# EAGLE design aecho (EAGLE 7.3.0)
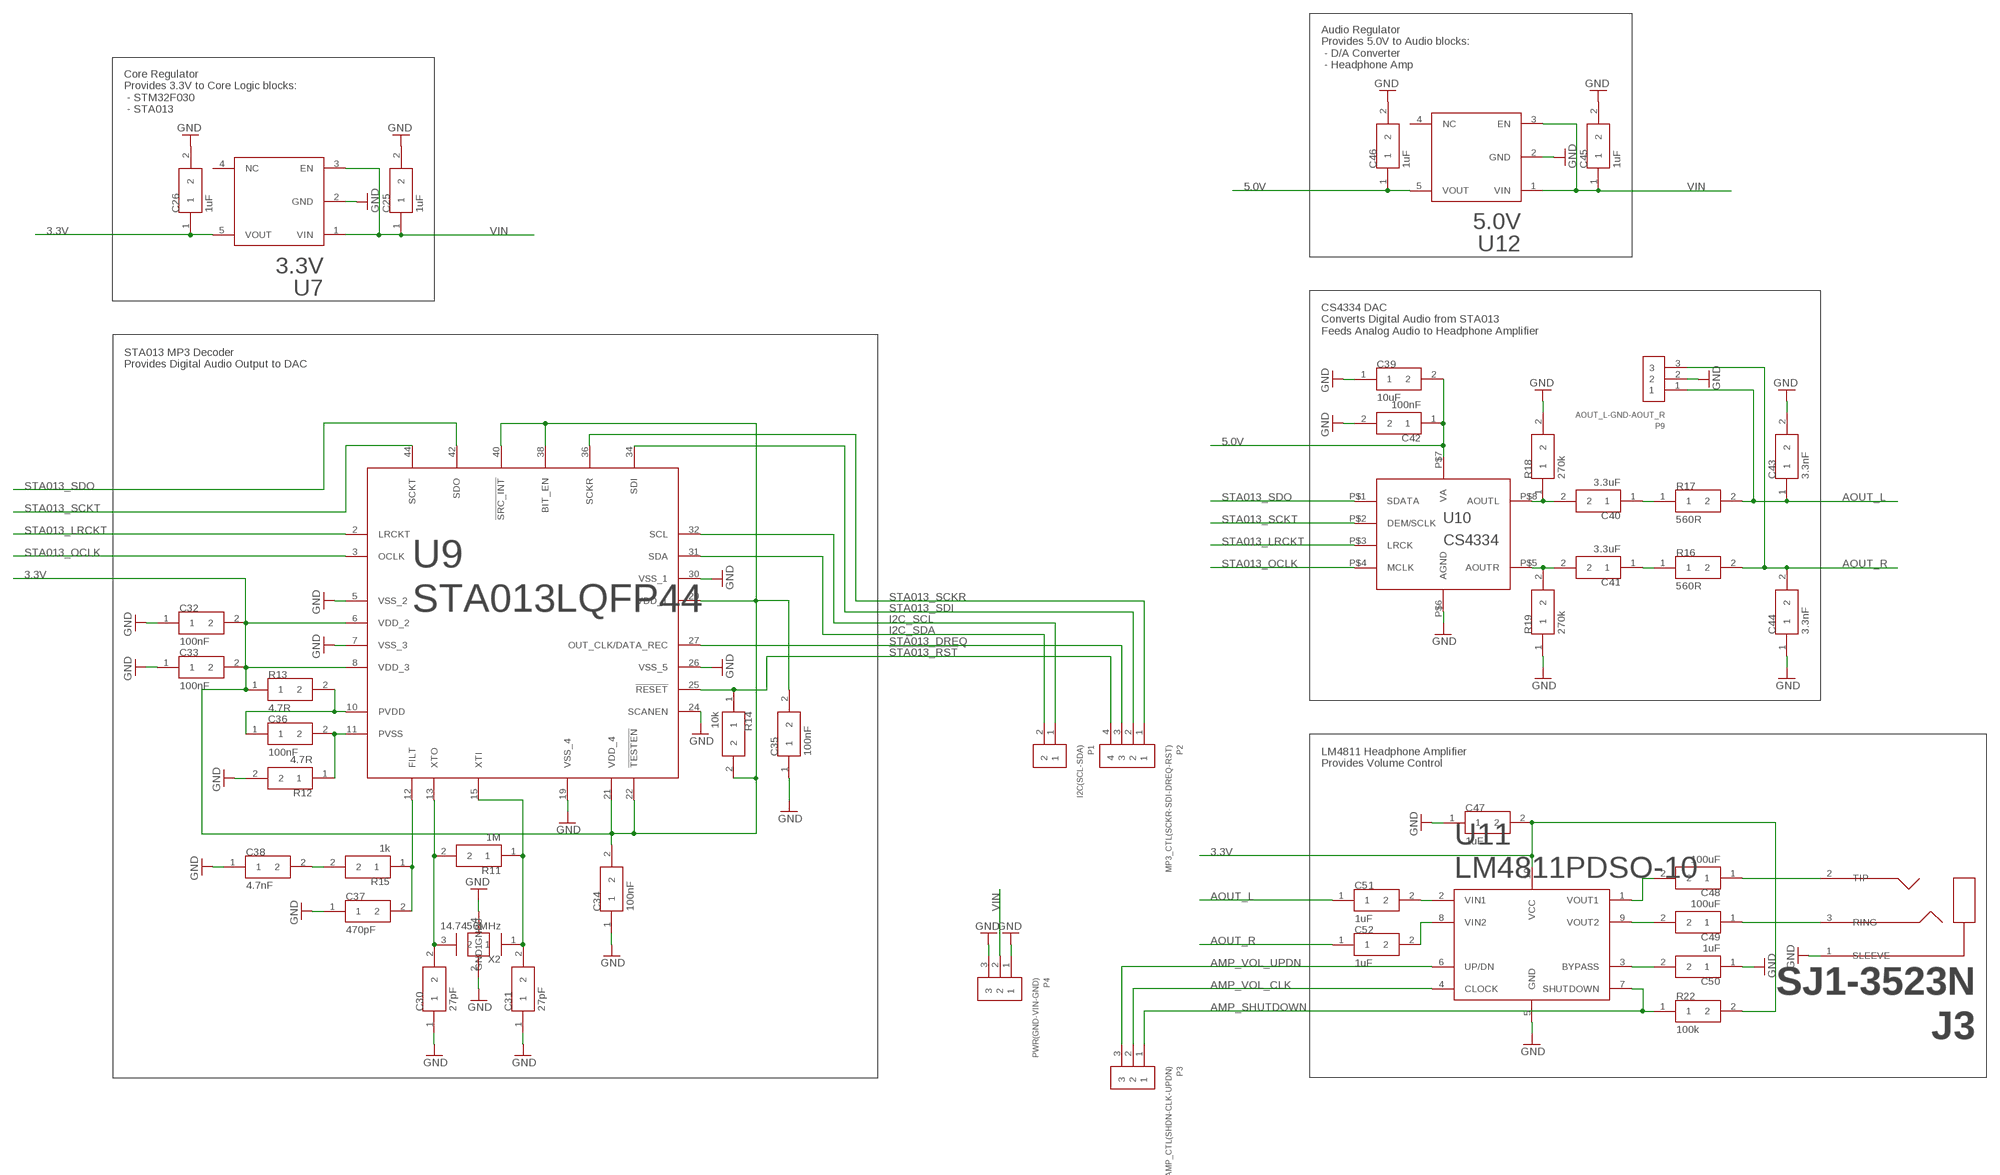
[diagram p0: schematic, sheet 1]

## Parts
C25  1uF  CAP0805  [0805]
C26  1uF  CAP0805  [0805]
C30  27pF  CAP0805  [0805]
C31  27pF  CAP0805  [0805]
C32  100nF  CAP0805  [0805]
C33  100nF  CAP0805  [0805]
C34  100nF  CAP0805  [0805]
C35  100nF  CAP0805  [0805]
C36  100nF  CAP0805  [0805]
C37  470pF  CAP0805  [0805]
C38  4.7nF  CAP0805  [0805]
C39  10uF  CAP0805  [0805]
C40  3.3uF  CAP0805  [0805]
C41  3.3uF  CAP0805  [0805]
C42  100nF  CAP0805  [0805]
C43  3.3nF  CAP0805  [0805]
C44  3.3nF  CAP0805  [0805]
C45  1uF  CAP0805  [0805]
C46  1uF  CAP0805  [0805]
C47  1uF  CAP0805  [0805]
C48  100uF  CAP1210  [1210]
C49  100uF  CAP1210  [1210]
C50  1uF  CAP0805  [0805]
C51  1uF  CAP0805  [0805]
C52  1uF  CAP0805  [0805]
J3  SJ1-3523N  [SJ1-352XN]
P1  I2C(SCL-SDA)  PIN_2  [PIN_2]
P2  MP3_CTL(SCKR-SDI-DREQ-RST)  PIN_4  [PIN_4]
P3  AMP_CTL(SHDN-CLK-UPDN)  PIN_3  [PIN_3]
P4  PWR(GND-VIN-GND)  PIN_3  [PIN_3]
P9  AOUT_L-GND-AOUT_R  PIN_3  [PIN_3]
R11  1M  RES0805  [0805]
R12  4.7R  RES0805  [0805]
R13  4.7R  RES0805  [0805]
R14  10k  RES0805  [0805]
R15  1k  RES0805  [0805]
R16  560R  RES0805  [0805]
R17  560R  RES0805  [0805]
R18  270k  RES0805  [0805]
R19  270k  RES0805  [0805]
R22  100k  RES0805  [0805]
U7  3.3V  LP3985SOT23-5  [SOT23-5]
U9  STA013LQFP44  [QFP44]
U10  CS4334  [SO8]
U11  LM4811PDSO-10  [PDSO-10]
U12  5.0V  LP3985SOT23-5  [SOT23-5]
X2  14.7456MHz  XTAL_GNDSMD_3225  [XTAL_3225]

## Nets
3.3V: C26.1 C32.2 C33.2 C34.2 C35.2 C47.2 R13.1 R14.2 R22.2 U7.5(VOUT) U9.6(VDD_2) U9.8(VDD_3) U9.21(VDD_4) U9.22(!TESTEN) U9.29(VDD_1) U9.38(BIT_EN) U9.40(!SRC_INT) U11.10(VCC)
5.0V: C39.2 C42.1 C46.1 U10.P$7(VA) U12.5(VOUT)
!STA013_RST: P2.4 R14.1 U9.25(!RESET)
AMP_SHUTDOWN: P3.1 R22.1 U11.7(SHUTDOWN)
AMP_VOL_CLK: P3.2 U11.4(CLOCK)
AMP_VOL_UPDN: P3.3 U11.6(UP/DN)
AOUT_L: C43.1 C51.1 P9.1 R17.2
AOUT_R: C44.2 C52.1 P9.3 R16.2
GND: C25.2 C26.2 C30.1 C31.1 C32.1 C33.1 C34.1 C35.1 C37.1 C38.1 C39.1 C42.2 C43.2 C44.1 C45.2 C46.2 C47.1 C50.1 J3.1(SLEEVE) P4.1 P4.3 P9.2 R12.2 R18.2 R19.1 U7.2(GND) U9.5(VSS_2) U9.7(VSS_3) U9.19(VSS_4) U9.24(SCANEN) U9.26(VSS_5) U9.30(VSS_1) U10.P$6(AGND) U11.5(GND) U12.2(GND) X2.2(GND0) X2.4(GND1)
I2C_SCL: P1.1 U9.32(SCL)
I2C_SDA: P1.2 U9.31(SDA)
N$2: C31.2 R11.1 U9.15(XTI) X2.1
N$3: C30.2 R11.2 U9.13(XTO) X2.3
N$6: C36.1 R13.2 U9.10(PVDD)
N$7: C36.2 R12.1 U9.11(PVSS)
N$8: C48.1 J3.2(TIP)
N$9: C38.2 R15.2
N$10: C40.2 R18.1 U10.P$8(AOUTL)
N$11: C37.2 R15.1 U9.12(FILT)
N$12: C41.2 R19.2 U10.P$5(AOUTR)
N$28: C41.1 R16.1
N$29: C40.1 R17.1
N$30: C48.2 U11.1(VOUT1)
N$31: C49.2 U11.9(VOUT2)
N$32: C50.2 U11.3(BYPASS)
N$34: C49.1 J3.3(RING)
N$39: C51.2 U11.2(VIN1)
N$40: C52.2 U11.8(VIN2)
STA013_DREQ: P2.3 U9.27(OUT_CLK/DATA_REC)
STA013_LRCKT: U9.2(LRCKT) U10.P$3(LRCK)
STA013_OCLK: U9.3(OCLK) U10.P$4(MCLK)
STA013_SCKR: P2.1 U9.36(SCKR)
STA013_SCKT: U9.44(SCKT) U10.P$2(DEM/SCLK)
STA013_SDI: P2.2 U9.34(SDI)
STA013_SDO: U9.42(SDO) U10.P$1(SDATA)
VIN: C25.1 C45.1 P4.2 U7.1(VIN) U7.3(EN) U12.1(VIN) U12.3(EN)
Unconnected: U7.4(NC) U12.4(NC)

## Notes on the sheet
- Audio Regulator
  Provides 5.0V to Audio blocks:
   - D/A Converter
   - Headphone Amp
- Core Regulator
  Provides 3.3V to Core Logic blocks:
   - STM32F030
   - STA013
- CS4334 DAC
  Converts Digital Audio from STA013
  Feeds Analog Audio to Headphone Amplifier
- STA013 MP3 Decoder
  Provides Digital Audio Output to DAC
- LM4811 Headphone Amplifier
  Provides Volume Control

## Library data of the parts
C25 C26 C30-C52 = dooba:CAP
J3 = dooba:SJ1-3523N
P1 = dooba:PIN_2
P2 = dooba:PIN_4
P3 P4 P9 = dooba:PIN_3
R11-R19 R22 = dooba:RES
U7 U12 = dooba:LP3985
U9 = dooba:STA013
U10 = dooba:CS4334
U11 = dooba:LM4811
X2 = dooba:XTAL_GND

## Board
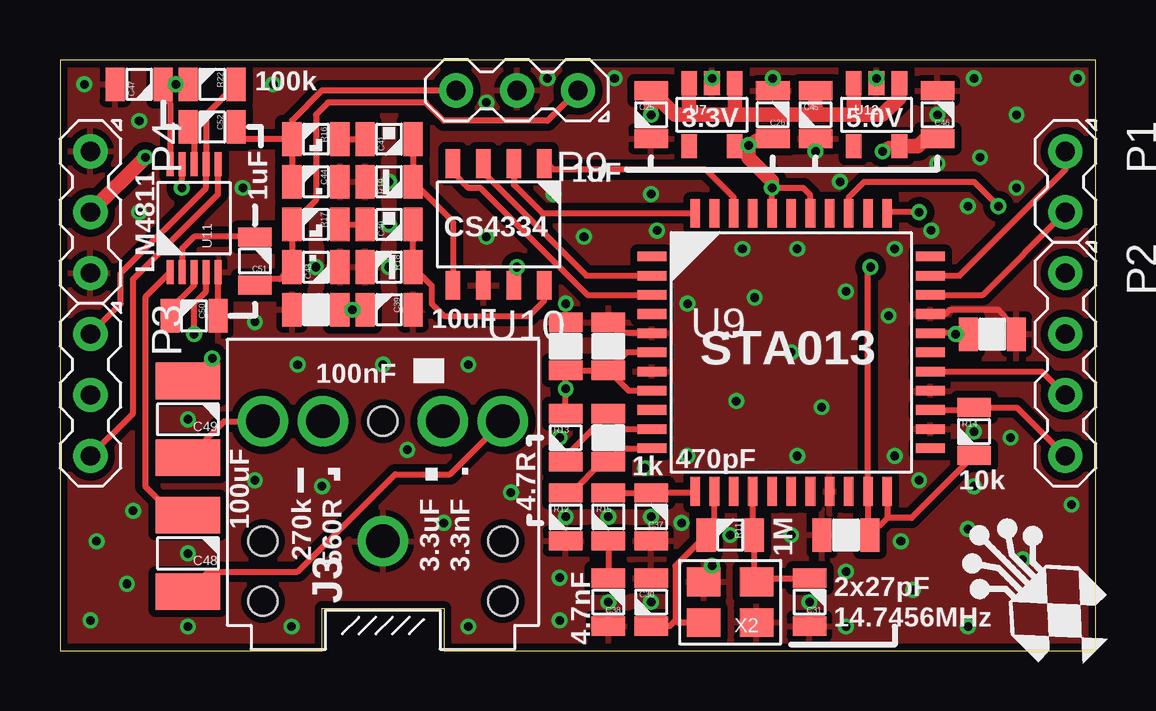
[diagram p1: board, top side]
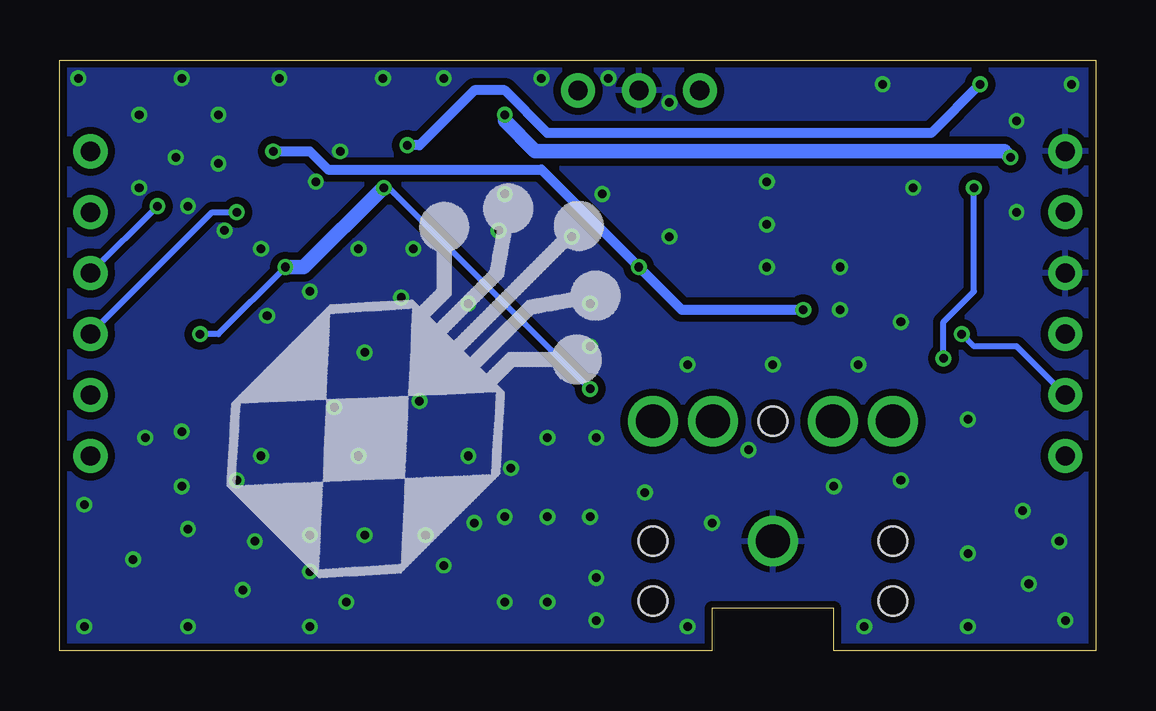
[diagram p2: board, bottom side, seen from below]

Size 43.18 x 24.64 mm. Coordinates in mm from the lower left corner, seen from the top.
Outline: 0,0 10.92,0 10.92,1.78 16,1.78 16,0 43.18,0 43.18,24.64 0,24.64 0,0
Copper layers (1*16): Top 0.035mm / dielectric 1.5mm / Bottom 0.035mm
Design rules "dooba": minimum track width 6mil, minimum drill 12mil, track to track 6mil, track to pad 6mil, pad to pad 6mil, via to via 6mil, smd to smd 0mil, copper to edge 10mil, drill to drill 10mil, minimum pad ring 10mil, minimum via ring 6mil, stop-mask expansion 2mil, vias tented up to drill 25mil, thermal gap 10mil

### Footprints (pad centres in the part's own frame; a part is rotated, then mirrored left to right if it is on the bottom)
0805 = smd 0.8 x 1.4: 1 -1,0; 2 1,0
1210 = smd 1.524 x 2.678: 1 -1.6,0; 2 1.6,0
SJ1-352XN = drill 1.4 pad 2: 1 0,0; 2 5,-5; 3 5,5; 4 5,-2.5; 5 5,2.5 | hole 1.2: 5,0; 0,-5; 0,5; -2.5,5; -2.5,-5
PIN_2 = drill 0.8 pad 1.422: 1 -1.27,0; 2 1.27,0
PIN_4 = drill 0.8 pad 1.422: 1 -3.81,0; 2 -1.27,0; 3 1.27,0; 4 3.81,0
PIN_3 = drill 0.8 pad 1.422: 1 -2.54,0; 2 0,0; 3 2.54,0
SOT23-5 = smd 0.66 x 1: 1 0.95,1.315; 2 0,1.315; 3 -0.95,1.315; 4 -0.95,-1.315; 5 0.95,-1.315
QFP44 = smd 1.2 x 0.4: 1 -5.8,4; 2 -5.8,3.2; 3 -5.8,2.4; 4 -5.8,1.6; 5 -5.8,0.8; 6 -5.8,0; 7 -5.8,-0.8; 8 -5.8,-1.6; 9 -5.8,-2.4; 10 -5.8,-3.2; 11 -5.8,-4; 23 5.8,-4; 24 5.8,-3.2; 25 5.8,-2.4; 26 5.8,-1.6; 27 5.8,-0.8; 28 5.8,0; 29 5.8,0.8; 30 5.8,1.6; 31 5.8,2.4; 32 5.8,3.2; 33 5.8,4 | smd 0.4 x 1.2: 12 -4,-5.8; 13 -3.2,-5.8; 14 -2.4,-5.8; 15 -1.6,-5.8; 16 -0.8,-5.8; 17 0,-5.8; 18 0.8,-5.8; 19 1.6,-5.8; 20 2.4,-5.8; 21 3.2,-5.8; 22 4,-5.8; 34 4,5.8; 35 3.2,5.8; 36 2.4,5.8; 37 1.6,5.8; 38 0.8,5.8; 39 0,5.8; 40 -0.8,5.8; 41 -1.6,5.8; 42 -2.4,5.8; 43 -3.2,5.8; 44 -4,5.8
SO8 = smd 0.6 x 1.2: P$1 -1.905,-2.54; P$2 -0.635,-2.54; P$3 0.635,-2.54; P$4 1.905,-2.54; P$5 1.905,2.54; P$6 0.635,2.54; P$7 -0.635,2.54; P$8 -1.905,2.54
PDSO-10 = smd 1 x 0.3: 1 -2.25,1; 2 -2.25,0.5; 3 -2.25,0; 4 -2.25,-0.5; 5 -2.25,-1; 6 2.25,-1; 7 2.25,-0.5; 8 2.25,0; 9 2.25,0.5; 10 2.25,1
XTAL_3225 = smd 1.4 x 1.2: 1 -1.1,-0.85; 2 1.1,-0.85; 3 1.1,0.85; 4 -1.1,0.85

### Placement (x,y rotation side)
C25  24.64,22.35 270 top
C26  29.72,22.35 90 top
C30  24.64,2.03 270 top
C31  31.24,2.03 90 top
C32  21.08,12.7 270 top
C33  22.86,12.7 270 top
C34  32.77,4.83 0 top
C35  38.86,13.21 180 top
C36  22.86,8.89 270 top
C37  24.64,5.59 90 top
C38  22.86,2.03 90 top
C39  13.72,14.22 180 top
C40  13.72,17.78 0 top
C41  13.72,21.34 0 top
C42  10.67,14.22 180 top
C43  10.67,16 0 top
C44  10.67,19.56 180 top
C45  31.5,22.35 270 top
C46  36.58,22.35 90 top
C47  3.3,23.62 0 top
C48  5.33,4.06 90 top
C49  5.33,9.65 90 top
C50  5.59,13.97 180 top
C51  8.13,16.26 90 top
C52  6.35,21.84 180 top
J3  13.46,4.57 90 top
P1  41.91,19.56 270 top
P2  41.91,11.94 270 top
P3  1.27,10.67 270 top
P4  1.27,18.29 270 top
P9  19.05,23.37 180 top
R11  27.94,4.83 180 top
R12  21.08,5.59 270 top
R13  21.08,8.89 270 top
R14  38.1,9.14 270 top
R15  22.86,5.59 270 top
R16  10.67,21.34 180 top
R17  10.67,17.78 180 top
R18  13.72,16 180 top
R19  13.72,19.56 0 top
R22  6.35,23.62 180 top
U7  27.18,22.35 0 top
U9  30.48,12.45 0 top
U10  18.29,17.78 180 top
U11  5.59,18.03 90 top
U12  34.04,22.35 0 top
X2  27.94,2.03 180 top

### Tracks (layer width: path | path; a pad name or v marks a point on that pad's centre or on a via)
3.3V  (via drill 0.36)
  Top 0.254: C47.2 4.32,23.61 4.32,23.11 4.59,22.84 U11.10 | v37.34,13.21 37.85,13.21 | 37.85,13.21 C35.2 | 37.85,13.21 37.81,13.25 U9.29 | v33.78,16 33.68,15.9 U9.21 33.68,4.91 C34.2 34.48,5.54 | U9.22 34.48,5.54 | R13.1 v21.08,10.92 C32.2 C33.2 | U9.6 23.61,12.45 C33.2 | U9.8 23.71,10.85 C33.2 | U9.40 v29.68,19.3 30.99,19.3 31.28,19.01 U9.38 | R14.2 35.5,5.54 34.48,5.54
  Top 0.406: R22.2 v4.83,23.62 C47.2 | U7.5 28.66,21.04 v28.7,21.08 28.97,21.35 C26.1
  Top 0.61: v28.7,21.08 28.7,20.57 29.68,19.6 v29.68,19.3
  Bottom 0.254: v33.78,16 36.58,13.21 v37.34,13.21 | v21.08,10.92 29.46,19.3 v29.68,19.3
  Bottom 0.406: v4.83,23.62 6.86,21.59 22.86,21.59 24.64,23.37 25.91,23.37 28.19,21.08 v28.7,21.08
  Bottom 0.61: v33.78,16 33.02,16 29.72,19.3 v29.68,19.3
5.0V  (via drill 0.36)
  Top 0.406: U12.5 34.5,21.04 v34.29,20.83 | C39.2 v12.19,14.22 C42.1 | U10.P$7 18.92,15.88 v19.05,16
  Top 0.61: U12.5 35.77,21.04 36.07,21.34 36.56,21.34 C46.1
  Bottom 0.406: v12.19,14.22 17.27,14.22 v19.05,16 23.11,20.07 32,20.07 32.77,20.83 v34.29,20.83
!STA013_RST
  Top 0.254: U9.25 38,10.05 R14.1 39.89,10.14 P2.4
AMP_SHUTDOWN
  Top 0.254: P3.1 2.54,14.48 2.54,15.75 6.09,19.3 U11.7 6.09,22.36 R22.1
AMP_VOL_CLK  (via drill 0.36)
  Top 0.254: v5.59,13.21 5.59,14.48 6.09,14.98 U11.4
  Bottom 0.254: P3.2 3.3,12.7 5.08,12.7 v5.59,13.21
AMP_VOL_UPDN
  Top 0.254: P3.3 3.05,9.91 3.05,15.49 6.59,19.03 U11.6
AOUT_L
  Top 0.254: C51.1 8.4,15.26 8.64,15.49 9.16,15.49 C43.1 R17.2 9.67,17.8 10.67,18.8 10.67,22.35 11.18,22.86 15.24,22.86 16,22.1 20.32,22.1 P9.1
AOUT_R
  Top 0.254: R16.2 C44.2 | R16.2 7.62,21.34 7.35,21.61 C52.1 | P9.3 10.92,23.37 9.67,22.11 R16.2
GND  (via drill 0.36)
  Top 0.254: U9.30 36.91,14.05 37.08,14.22 39.12,14.22 39.62,13.72 39.62,13.45 C35.1 | U9.5 23.31,13.25 C33.1 | C50.1 U11.5
  other vias: 8.89,23.62 7.62,19.3 3.3,22.1 1.02,23.62 3.3,18.29 8.13,13.72 5.33,9.65 5.33,4.06 3.05,5.84 1.27,1.27 2.79,2.79 1.52,4.57 5.33,1.02 20.83,3.05 20.83,1.27 32.77,3.3 27.18,3.56 24.64,2.03 22.86,2.03 21.08,5.59 22.86,5.59 24.64,5.59 25.91,5.33 24.38,7.62 22.86,8.89 20.83,8.89 21.08,12.7 17.78,17.27 23.11,23.88 24.64,19.05 17.78,22.86 20.32,23.88 10.67,16 10.67,14.22 13.72,16 13.72,19.56 13.72,17.78 10.92,6.86 16,5.33 9.91,11.94 13.46,11.94 17.02,11.94 9.65,1.02 17.02,1.02 18.8,6.6 8.13,7.11 14.48,8.38 31.24,2.03 32.77,1.02 42.16,1.02 42.16,6.1 39.62,8.89 38.1,9.14 35.05,4.57 38.1,6.86 37.85,1.02 35.56,2.54 40.13,3.81 37.85,5.08 35.81,7.11 32.77,4.83 30.48,4.83 27.94,4.83 21.84,17.27 24.89,17.53 20.57,19.05 28.45,16.76 26.16,14.48 26.16,8.13 34.8,8.13 34.8,16.76 30.73,16.76 32.77,14.99 34.54,13.97 30.73,8.13 30.48,12.45 28.19,10.41 28.96,14.73 31.75,10.16 37.85,18.54 31.5,20.83 36.58,20.32 27.18,23.88 34.04,23.88 29.72,23.88 32.51,19.56 36.58,22.35 38.1,23.88 42.42,23.88 39.88,19.3 38.35,20.57 39.88,22.35 21.08,14.48 36.32,17.53
  pour Top (isolate 0.305): 0,24.64 43.18,24.64 43.18,0 0,0
  pour Bottom (isolate 0.305): 0,24.64 43.18,24.64 43.18,0 0,0
I2C_SCL
  Top 0.254: U9.32 37.49,15.65 41.91,20.07 P1.1
I2C_SDA
  Top 0.254: U9.31 38.47,14.85 P1.2
N$2
  Top 0.254: U9.15 28.88,4.89 R11.1 28.94,2.98 X2.1 29.19,3.03 C31.2
N$3
  Top 0.254: U9.13 27.28,5.17 R11.2 25.65,3.54 25.65,1.27 | 25.65,1.27 25.74,1.18 X2.3 | 25.65,1.27 25.42,1.03 C30.2
N$6
  Top 0.254: U9.10 23.5,9.25 C36.1 21.08,8.11 R13.2
N$7
  Top 0.254: U9.11 23.42,8.45 C36.2 22.62,7.89 21.34,6.6 21.1,6.6 R12.1
N$8
  Top 0.254: C48.1 6.17,3.3 9.91,3.3 13.97,7.37 16.26,7.37 J3.2
N$9
  Top 0.254: R15.2 C38.2
N$10
  Top 0.254: C40.2 R18.1 15.49,15.22 15.49,14.48 16,13.97 19.56,13.97 20.19,14.61 U10.P$8
N$11
  Top 0.254: R15.1 C37.2 26.42,6.59 U9.12
N$12
  Top 0.254: C41.2 R19.2 16.38,17.89 U10.P$5
N$28
  Top 0.254: R16.1 C41.1
N$29
  Top 0.254: R17.1 C40.1
N$30
  Top 0.254: U11.1 3.56,14.75 3.56,6.86 4.75,5.66 C48.2
N$31  (via drill 0.36)
  Top 0.254: C49.2 6.27,12.19 v6.35,12.19 | v5.08,19.3 v5.09,19.31 U11.9
  Bottom 0.254: v6.35,12.19 6.35,13.72 5.08,14.99 v5.08,19.3
N$32
  Top 0.254: C50.2 4.57,13.99 4.57,14.22 5.59,15.24 U11.3
N$34
  Top 0.254: C49.1 6.85,9.57 J3.3
N$39
  Top 0.254: C51.2 8.11,17.27 5.59,17.27 5.09,16.77 U11.2
N$40
  Top 0.254: C52.2 5.59,21.61 U11.8
STA013_DREQ
  Top 0.254: U9.27 40.93,11.65 P2.3
STA013_LRCKT
  Top 0.254: U10.P$3 17.65,19.94 21.95,15.65 U9.2
STA013_OCLK
  Top 0.254: U9.3 21.98,14.85 17.53,19.3 17.02,19.3 16.38,19.94 U10.P$4
STA013_SCKR  (via drill 0.36)
  Top 0.254: U9.36 32.88,18.91 33.53,19.56 38.1,19.56 v39.12,18.54
  Bottom 0.254: v39.12,18.54 P2.1
STA013_SCKT
  Top 0.254: U10.P$2 18.92,19.43 20.11,18.25 U9.44
STA013_SDI  (via drill 0.36)
  Top 0.254: v35.81,18.29 34.52,18.29 U9.34
  Bottom 0.254: P2.2 36.83,18.29 v35.81,18.29
STA013_SDO
  Top 0.254: U9.42 28.08,18.91 26.92,20.07 20.57,20.07 20.32,20.32 U10.P$1
VIN  (via drill 0.36)
  Top 0.61: 26.16,22.35 25.64,22.35 C25.1 v24.64,22.35 | 26.16,22.35 28.19,22.35 | 28.19,22.35 31.5,22.35 | 31.5,22.35 33.27,22.35 | U12.1 34.99,23.05 34.29,22.35 33.27,22.35 | 33.27,22.35 33.09,22.54 U12.3 | C45.1 31.5,22.35 | 28.19,22.35 28.13,22.42 U7.1 | 26.16,22.35 26.23,22.42 U7.3 | P4.2 v3.56,20.57
  Bottom 0.61: v3.56,20.57 3.81,20.83 23.37,20.83 24.64,22.1 v24.64,22.35

### Text on the board
tPlace: 100k | 3.3V | 5.0V | 1uF | 1uF | CS4334 | LM4811 | 10uF | STA013 | 100nF | 1k | 470pF | 270k | 560R | 3.3uF | 3.3nF | 10k | 4.7R | 1M | 100uF | 2x27pF | 4.7nF | 14.7456MHz